# Altium schematic sheet DSPCONN.0-3.SCHDOC: Backplane
size B; Engineer: Eric Jonas; Organization: Wilson Lab; Address1: Picower Institute, MIT; Address2: 43 Vassar St. 46-5227; Address3: Cambridge, MA 02139; Address4: Australia 2086
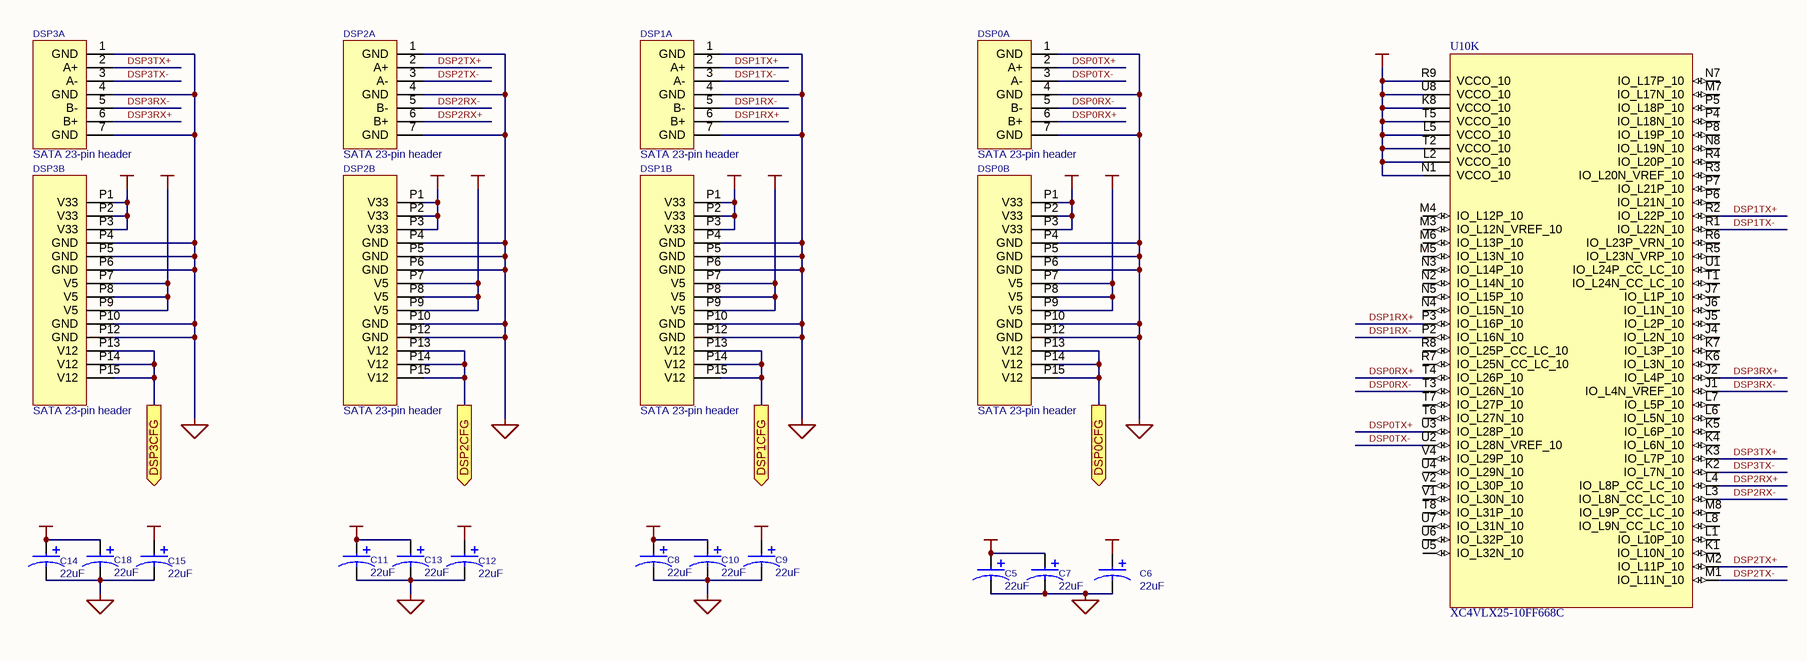
[diagram p0: DSPCONN.0-3.SCHDOC]

## Parts
C5  value 22uF  [6032]
C6  value 22uF  [6032]
C7  value 22uF  [6032]
C8  value 22uF  [6032]
C9  value 22uF  [6032]
C10  value 22uF  [6032]
C11  value 22uF  [6032]
C12  value 22uF  [6032]
C13  value 22uF  [6032]
C14  value 22uF  [6032]
C15  value 22uF  [6032]
C18  value 22uF  [6032]
DSP0  SATA 23-pin header  [MOLEX 87713-1001]  (parts A,B of 2)
DSP1  SATA 23-pin header  [MOLEX 87713-1001]  (parts A,B of 2)
DSP2  SATA 23-pin header  [MOLEX 87713-1001]  (parts A,B of 2)
DSP3  SATA 23-pin header  [MOLEX 87713-1001]  (parts A,B of 2)
U10  XC4VLX25-10FF668C  [Xilinx FF668]  (part K of 13)

## Ports
DSP0CFG (out), DSP1CFG (out), DSP2CFG (out), DSP3CFG (out)

## Nets
+2.5VCC: U10.K8(VCCO_10) U10.L2(VCCO_10) U10.L5(VCCO_10) U10.N1(VCCO_10) U10.R9(VCCO_10) U10.T2(VCCO_10) U10.T5(VCCO_10) U10.U8(VCCO_10)
+5VCC: C6.1 C9.1 C12.1 C15.1 DSP0.P7(V5) DSP0.P8(V5) DSP0.P9(V5) DSP1.P7(V5) DSP1.P8(V5) DSP1.P9(V5) DSP2.P7(V5) DSP2.P8(V5) DSP2.P9(V5) DSP3.P7(V5) DSP3.P8(V5) DSP3.P9(V5)
GND: C5.2 C6.2 C7.2 C8.2 C9.2 C10.2 C11.2 C12.2 C13.2 C14.2 C15.2 C18.2 DSP0.1(GND) DSP0.4(GND) DSP0.7(GND) DSP0.P4(GND) DSP0.P5(GND) DSP0.P6(GND) DSP0.P10(GND) DSP0.P12(GND) DSP1.1(GND) DSP1.4(GND) DSP1.7(GND) DSP1.P4(GND) DSP1.P5(GND) DSP1.P6(GND) DSP1.P10(GND) DSP1.P12(GND) DSP2.1(GND) DSP2.4(GND) DSP2.7(GND) DSP2.P4(GND) DSP2.P5(GND) DSP2.P6(GND) DSP2.P10(GND) DSP2.P12(GND) DSP3.1(GND) DSP3.4(GND) DSP3.7(GND) DSP3.P4(GND) DSP3.P5(GND) DSP3.P6(GND) DSP3.P10(GND) DSP3.P12(GND)
VCC: C5.1 C7.1 C8.1 C10.1 C11.1 C13.1 C14.1 C18.1 DSP0.P1(V33) DSP0.P2(V33) DSP0.P3(V33) DSP1.P1(V33) DSP1.P2(V33) DSP1.P3(V33) DSP2.P1(V33) DSP2.P2(V33) DSP2.P3(V33) DSP3.P1(V33) DSP3.P2(V33) DSP3.P3(V33)
DSP0CFG: DSP0.P13(V12) DSP0.P14(V12) DSP0.P15(V12) ; port DSP0CFG
DSP0RX+: DSP0.6(B+) U10.T4(IO_L26P_10)
DSP0RX-: DSP0.5(B-) U10.T3(IO_L26N_10)
DSP0TX+: DSP0.2(A+) U10.U3(IO_L28P_10)
DSP0TX-: DSP0.3(A-) U10.U2(IO_L28N_VREF_10)
DSP1CFG: DSP1.P13(V12) DSP1.P14(V12) DSP1.P15(V12) ; port DSP1CFG
DSP1RX+: DSP1.6(B+) U10.P3(IO_L16P_10)
DSP1RX-: DSP1.5(B-) U10.P2(IO_L16N_10)
DSP1TX+: DSP1.2(A+) U10.R2(IO_L22P_10)
DSP1TX-: DSP1.3(A-) U10.R1(IO_L22N_10)
DSP2CFG: DSP2.P13(V12) DSP2.P14(V12) DSP2.P15(V12) ; port DSP2CFG
DSP2RX+: DSP2.6(B+) U10.L4(IO_L8P_CC_LC_10)
DSP2RX-: DSP2.5(B-) U10.L3(IO_L8N_CC_LC_10)
DSP2TX+: DSP2.2(A+) U10.M2(IO_L11P_10)
DSP2TX-: DSP2.3(A-) U10.M1(IO_L11N_10)
DSP3CFG: DSP3.P13(V12) DSP3.P14(V12) DSP3.P15(V12) ; port DSP3CFG
DSP3RX+: DSP3.6(B+) U10.J2(IO_L4P_10)
DSP3RX-: DSP3.5(B-) U10.J1(IO_L4N_VREF_10)
DSP3TX+: DSP3.2(A+) U10.K3(IO_L7P_10)
DSP3TX-: DSP3.3(A-) U10.K2(IO_L7N_10)

Not connected (* = marked no-connect by the designer): U10 J4(IO_L2N_10) J5(IO_L2P_10) J6(IO_L1N_10) J7(IO_L1P_10) K1(IO_L10N_10) K4(IO_L6N_10) K5(IO_L6P_10) K6(IO_L3N_10) K7(IO_L3P_10) L1(IO_L10P_10) L6(IO_L5N_10) L7(IO_L5P_10) L8(IO_L9N_CC_LC_10) M3(IO_L12N_VREF_10) M4(IO_L12P_10) M5(IO_L13N_10) M6(IO_L13P_10) M7(IO_L17N_10) M8(IO_L9P_CC_LC_10) N2(IO_L14N_10) N3(IO_L14P_10) N4(IO_L15N_10) N5(IO_L15P_10) N7(IO_L17P_10) N8(IO_L19N_10) P4(IO_L18N_10) P5(IO_L18P_10) P6(IO_L21N_10) P7(IO_L21P_10) P8(IO_L19P_10) R3(IO_L20N_VREF_10) R4(IO_L20P_10) R5(IO_L23N_VRP_10) R6(IO_L23P_VRN_10) R7(IO_L25N_CC_LC_10) R8(IO_L25P_CC_LC_10) T1(IO_L24N_CC_LC_10) T6(IO_L27N_10) T7(IO_L27P_10) T8(IO_L31P_10) U1(IO_L24P_CC_LC_10) U4(IO_L29N_10) U5(IO_L32N_10) U6(IO_L32P_10) U7(IO_L31N_10) V1(IO_L30N_10) V2(IO_L30P_10) V4(IO_L29P_10)

## Notes on the sheet
- Title:
- Engineer:
- Date:
- Revision:
- Sheet
- of
- File:

## Library data of the parts
C5-C15 C18 = POLCAP2: Standard Capacitor
DSP0-DSP3 = SATA-23
U10 = XC4VLX25-10FF668C: Xilinx Virtex-4